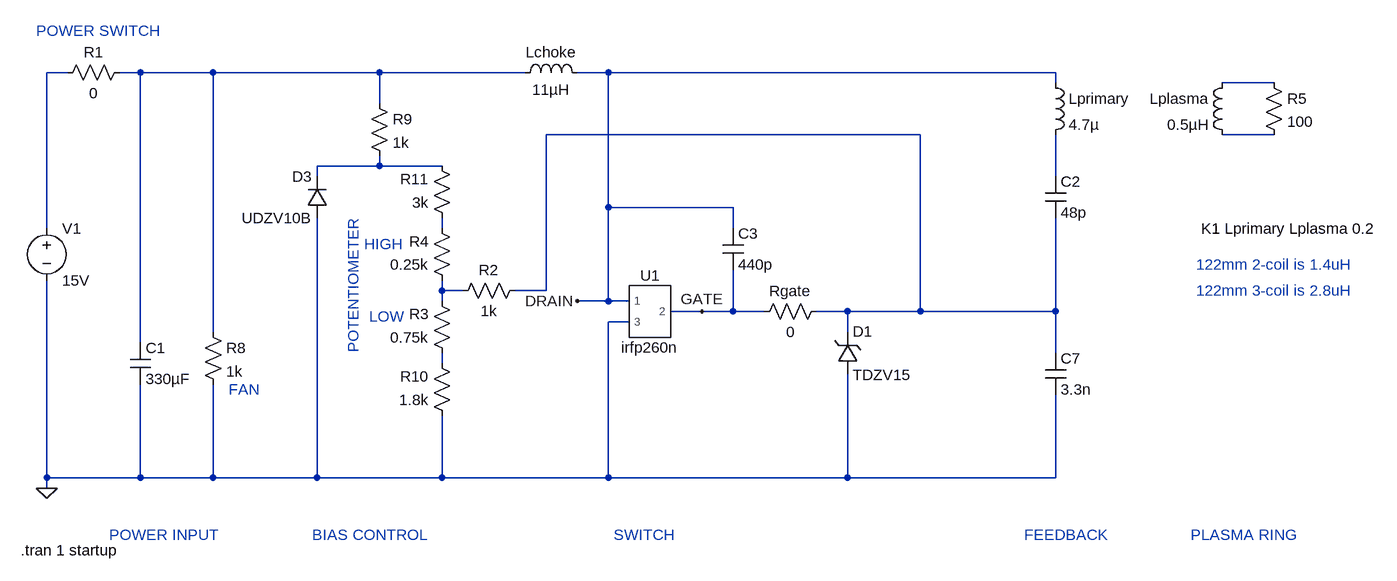
[diagram p0: schematic PlasmaTransformer.asc]
PlasmaTransformer.asc, the LTspice schematic file:
Version 4.1
SHEET 1 2388 680
WIRE 128 -432 96 -432
WIRE 240 -432 208 -432
WIRE 352 -432 240 -432
WIRE 608 -432 352 -432
WIRE 832 -432 608 -432
WIRE 960 -432 912 -432
WIRE 1648 -432 960 -432
WIRE 1648 -416 1648 -432
WIRE 1984 -416 1904 -416
WIRE 608 -384 608 -432
WIRE 1440 -336 864 -336
WIRE 1984 -336 1904 -336
WIRE 608 -288 608 -304
WIRE 608 -288 512 -288
WIRE 704 -288 608 -288
WIRE 512 -272 512 -288
WIRE 1648 -272 1648 -336
WIRE 960 -224 960 -432
WIRE 1152 -224 960 -224
WIRE 96 -192 96 -432
WIRE 704 -192 704 -208
WIRE 1152 -192 1152 -224
WIRE 704 -96 704 -112
WIRE 736 -96 704 -96
WIRE 864 -96 864 -336
WIRE 864 -96 816 -96
WIRE 704 -80 704 -96
WIRE 960 -80 960 -224
WIRE 960 -80 912 -80
WIRE 992 -80 960 -80
WIRE 1104 -64 1056 -64
WIRE 1152 -64 1152 -128
WIRE 1152 -64 1104 -64
WIRE 1200 -64 1152 -64
WIRE 1328 -64 1280 -64
WIRE 1440 -64 1440 -336
WIRE 1440 -64 1328 -64
WIRE 1648 -64 1648 -208
WIRE 1648 -64 1440 -64
WIRE 992 -48 960 -48
WIRE 352 -32 352 -432
WIRE 1328 -32 1328 -64
WIRE 240 -16 240 -432
WIRE 1648 0 1648 -64
WIRE 704 16 704 0
WIRE 96 192 96 -112
WIRE 240 192 240 48
WIRE 240 192 96 192
WIRE 352 192 352 48
WIRE 352 192 240 192
WIRE 512 192 512 -208
WIRE 512 192 352 192
WIRE 704 192 704 96
WIRE 704 192 512 192
WIRE 960 192 960 -48
WIRE 960 192 704 192
WIRE 1328 192 1328 32
WIRE 1328 192 960 192
WIRE 1648 192 1648 64
WIRE 1648 192 1328 192
WIRE 96 208 96 192
FLAG 96 208 0
FLAG 1104 -64 GATE
FLAG 912 -80 DRAIN
SYMBOL voltage 96 -208 R0
SYMATTR InstName V1
SYMATTR Value 15V
SYMBOL res 224 -448 R90
WINDOW 0 0 56 VBottom 2
WINDOW 3 32 56 VTop 2
SYMATTR InstName R1
SYMATTR Value 0
SYMBOL cap 224 -16 R0
SYMATTR InstName C1
SYMATTR Value 330µF
SYMBOL ind 816 -416 R270
WINDOW 0 32 56 VTop 2
WINDOW 3 5 56 VBottom 2
SYMATTR InstName Lchoke
SYMATTR Value 11µH
SYMATTR SpiceLine Rser=16m
SYMBOL ind 1632 -432 R0
SYMATTR InstName Lprimary
SYMATTR Value 4.7µ
SYMATTR SpiceLine Rser=16m
SYMBOL ind 1920 -432 M0
SYMATTR InstName Lplasma
SYMATTR Value 0.5µH
SYMBOL cap 1632 -272 R0
SYMATTR InstName C2
SYMATTR Value 48p
SYMBOL cap 1632 64 M180
WINDOW 0 24 56 Left 2
WINDOW 3 24 8 Left 2
SYMATTR InstName C7
SYMATTR Value 3.3n
SYMBOL TVSdiode 1312 32 M180
WINDOW 0 24 65 Left 2
WINDOW 3 24 -2 Left 2
SYMATTR InstName D1
SYMATTR Value TDZV15
SYMBOL res 720 -80 R270
WINDOW 0 32 56 VTop 2
WINDOW 3 0 56 VBottom 2
SYMATTR InstName R2
SYMATTR Value 1k
SYMBOL res 720 16 R180
WINDOW 0 36 76 Left 2
WINDOW 3 36 40 Left 2
SYMATTR InstName R3
SYMATTR Value 0.75k
SYMBOL res 720 -96 R180
WINDOW 0 36 76 Left 2
WINDOW 3 36 40 Left 2
SYMATTR InstName R4
SYMATTR Value 0.25k
SYMBOL res 336 -48 R0
SYMATTR InstName R8
SYMATTR Value 1k
SYMBOL res 592 -400 R0
SYMATTR InstName R9
SYMATTR Value 1k
SYMBOL diode 528 -208 R180
WINDOW 0 24 64 Left 2
WINDOW 3 24 0 Left 2
SYMATTR InstName D3
SYMATTR Value UDZV10B
SYMBOL res 720 112 R180
WINDOW 0 36 76 Left 2
WINDOW 3 36 40 Left 2
SYMATTR InstName R10
SYMATTR Value 1.8k
SYMBOL res 720 -192 R180
WINDOW 0 36 76 Left 2
WINDOW 3 36 40 Left 2
SYMATTR InstName R11
SYMATTR Value 3k
SYMBOL res 1968 -432 R0
SYMATTR InstName R5
SYMATTR Value 100
SYMBOL irfp260n 1024 -64 M0
SYMATTR InstName U1
SYMBOL res 1296 -80 R90
WINDOW 0 0 56 VBottom 2
WINDOW 3 32 56 VTop 2
SYMATTR InstName Rgate
SYMATTR Value 0
SYMBOL cap 1136 -192 R0
SYMATTR InstName C3
SYMATTR Value 440p
TEXT 80 -496 Left 2 ;POWER SWITCH
TEXT 568 -208 VRight 2 ;POTENTIOMETER
TEXT 592 -56 Left 2 ;LOW
TEXT 584 -168 Left 2 ;HIGH
TEXT 376 56 Left 2 ;FAN
TEXT 1872 -192 Left 2 !K1 Lprimary Lplasma 0.2
TEXT 1856 280 Left 2 ;PLASMA RING
TEXT 192 280 Left 2 ;POWER INPUT
TEXT 504 280 Left 2 ;BIAS CONTROL
TEXT 968 280 Left 2 ;SWITCH
TEXT 1600 280 Left 2 ;FEEDBACK
TEXT 56 304 Left 2 !.tran 1 startup
TEXT 1864 -136 Left 2 ;122mm 2-coil is 1.4uH
TEXT 1864 -96 Left 2 ;122mm 3-coil is 2.8uH

The netlist it stands for:
* PlasmaTransformer.asc
V1 N001 0 15V
R1 N002 N001 0
C1 N002 0 330µF
Lchoke N002 DRAIN 11µH Rser=16m
Lprimary DRAIN N007 4.7µ Rser=16m
Lplasma N003 N005 0.5µH
C2 N007 N004 48p
C7 0 N004 3.3n
D1 0 N004 TDZV15
R2 N009 N004 1k
R3 N010 N009 0.75k
R4 N009 N008 0.25k
R8 N002 0 1k
R9 N002 N006 1k
D3 0 N006 UDZV10B
R10 0 N010 1.8k
R11 N008 N006 3k
R5 N003 N005 100
X§U1 DRAIN GATE 0 irfp260n  ; pins 1 2 3
Rgate N004 GATE 0
C3 DRAIN GATE 440p
.model D D
.lib standard.dio
* POWER SWITCH
* POTENTIOMETER
* LOW
* HIGH
* FAN
K1 Lprimary Lplasma 0.2
* PLASMA RING
* POWER INPUT
* BIAS CONTROL
* SWITCH
* FEEDBACK
.tran 1 startup
* 122mm 2-coil is 1.4uH
* 122mm 3-coil is 2.8uH
.lib C:\Users\userl\Downloads\irfp260n.spi
.backanno
.end